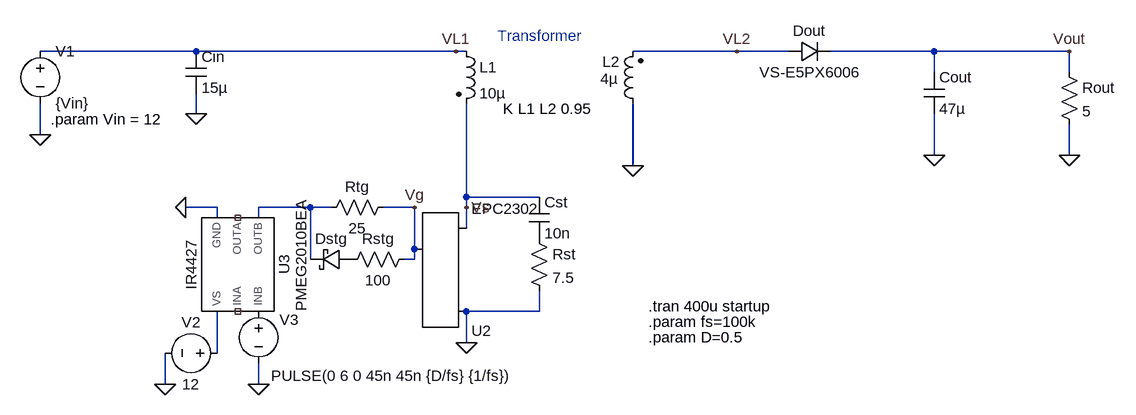
[diagram p0: schematic Flyback V4.asc]
Flyback V4.asc, the LTspice schematic file:
Version 4
SHEET 1 1032 680
WIRE -496 -288 -736 -288
WIRE -96 -288 -496 -288
WIRE -80 -288 -96 -288
WIRE 336 -288 176 -288
WIRE 416 -288 336 -288
WIRE 640 -288 480 -288
WIRE 848 -288 640 -288
WIRE 640 -256 640 -288
WIRE 848 -256 848 -288
WIRE -496 -192 -496 -224
WIRE -736 -160 -736 -208
WIRE 640 -128 640 -192
WIRE 848 -128 848 -176
WIRE 176 -112 176 -208
WIRE -80 -64 -80 -208
WIRE 32 -64 -80 -64
WIRE -464 -48 -512 -48
WIRE -320 -48 -400 -48
WIRE -288 -48 -320 -48
WIRE -160 -48 -208 -48
WIRE -80 -48 -80 -64
WIRE -464 -32 -464 -48
WIRE -400 -32 -400 -48
WIRE -80 -16 -80 -48
WIRE -160 16 -160 -48
WIRE -320 32 -320 -48
WIRE -160 32 -160 16
WIRE -160 32 -176 32
WIRE 32 112 32 80
WIRE 32 112 -80 112
WIRE -80 160 -80 112
WIRE -464 176 -464 112
WIRE -544 224 -544 176
WIRE -400 224 -400 192
FLAG 176 -112 0
FLAG 848 -128 0
FLAG -80 160 0
FLAG -736 -160 0
FLAG 848 -288 Vout
FLAG -96 -288 VL1
FLAG 336 -288 VL2
FLAG -544 224 0
FLAG -512 -48 0
FLAG -400 224 0
FLAG -160 -48 Vg
FLAG -80 -48 Vs
FLAG 640 -128 0
FLAG -496 -192 0
SYMBOL ind2 -96 -304 R0
SYMATTR InstName L1
SYMATTR Value 10µ
SYMBOL ind2 192 -192 R180
WINDOW 0 36 80 Left 2
WINDOW 3 39 54 Left 2
SYMATTR InstName L2
SYMATTR Value 4µ
SYMBOL voltage -736 -304 R0
WINDOW 123 0 0 Left 0
WINDOW 39 24 44 Left 2
SYMATTR InstName V1
SYMATTR Value {Vin}
SYMBOL diode 416 -272 R270
WINDOW 0 32 32 VTop 2
WINDOW 3 0 32 VBottom 2
SYMATTR InstName Dout
SYMATTR Value VS-E5PX6006
SYMBOL res 832 -272 R0
SYMATTR InstName Rout
SYMATTR Value 5
SYMBOL voltage -448 176 R90
WINDOW 0 -32 56 VBottom 2
WINDOW 3 32 56 VTop 2
WINDOW 123 0 0 Left 0
WINDOW 39 0 0 Left 0
SYMATTR InstName V2
SYMATTR Value 12
SYMBOL voltage -400 96 R0
WINDOW 123 0 0 Left 0
WINDOW 39 0 0 Left 0
WINDOW 3 19 115 Left 2
WINDOW 0 32 29 Left 2
SYMATTR Value PULSE(0 6 0 45n 45n {D/fs} {1/fs})
SYMATTR InstName V3
SYMBOL IR4427 -432 32 R90
SYMATTR InstName U3
SYMBOL res -304 -32 R270
WINDOW 0 32 56 VTop 2
WINDOW 3 0 56 VBottom 2
SYMATTR InstName Rtg
SYMATTR Value 25
SYMBOL cap 624 -256 R0
SYMATTR InstName Cout
SYMATTR Value 47µ
SYMBOL cap 16 -64 R0
SYMATTR InstName Cst
SYMATTR Value 10n
SYMBOL res 16 -16 R0
SYMATTR InstName Rst
SYMATTR Value 7.5
SYMBOL schottky -256 16 R90
WINDOW 0 0 32 VBottom 2
WINDOW 3 10 63 Top 2
SYMATTR InstName Dstg
SYMATTR Value PMEG2010BEA
SYMATTR Description Diode
SYMATTR Type diode
SYMBOL res -160 16 R90
WINDOW 0 0 56 VBottom 2
WINDOW 3 32 56 VTop 2
SYMATTR InstName Rstg
SYMATTR Value 100
SYMBOL cap -512 -288 R0
SYMATTR InstName Cin
SYMATTR Value 15µ
SYMBOL EPCGaN -160 16 M180
SYMATTR InstName U2
SYMATTR Value EPC2302
TEXT -24 -200 Left 2 !K L1 L2 0.95
TEXT -720 -184 Left 2 !.param Vin = 12
TEXT 200 104 Left 2 !.tran 400u startup
TEXT 200 128 Left 2 !.param fs=100k
TEXT 200 152 Left 2 !.param D=0.5
TEXT -32 -312 Left 2 ;Transformer

The netlist it stands for:
* Flyback V4.asc
L1 VL1 Vs 10µ
L2 0 VL2 4µ
V1 VL1 0 {Vin}
Dout VL2 Vout VS-E5PX6006
Rout Vout 0 5
V2 N002 0 12
V3 P001 0 PULSE(0 6 0 45n 45n {D/fs} {1/fs})
XU3 N001 NC_01 0 P001 NC_02 N002 IR4427  ; pins OUTB OUTA GND INB INA VS
Rtg N001 Vg 25
Cout Vout 0 47µ
Cst Vs P002 10n
Rst P002 0 7.5
Dstg P003 N001 PMEG2010BEA
Rstg Vg P003 100
Cin VL1 0 15µ
XU2 Vg 0 Vs EPC2302
.model D D
.lib standard.dio
K L1 L2 0.95
.param Vin = 12
.tran 400u startup
.param fs=100k
.param D=0.5
* Transformer
.lib D:\Users\C1\Documents\C1_Repos\Technion_Project_A\LTSPICE\Components\Libraries\IR4427.lib
.backanno
.end